# Altium schematic sheet Humidifier.SchDoc: Actuators
size A3; SheetNumber: 1; SheetTotal: 1
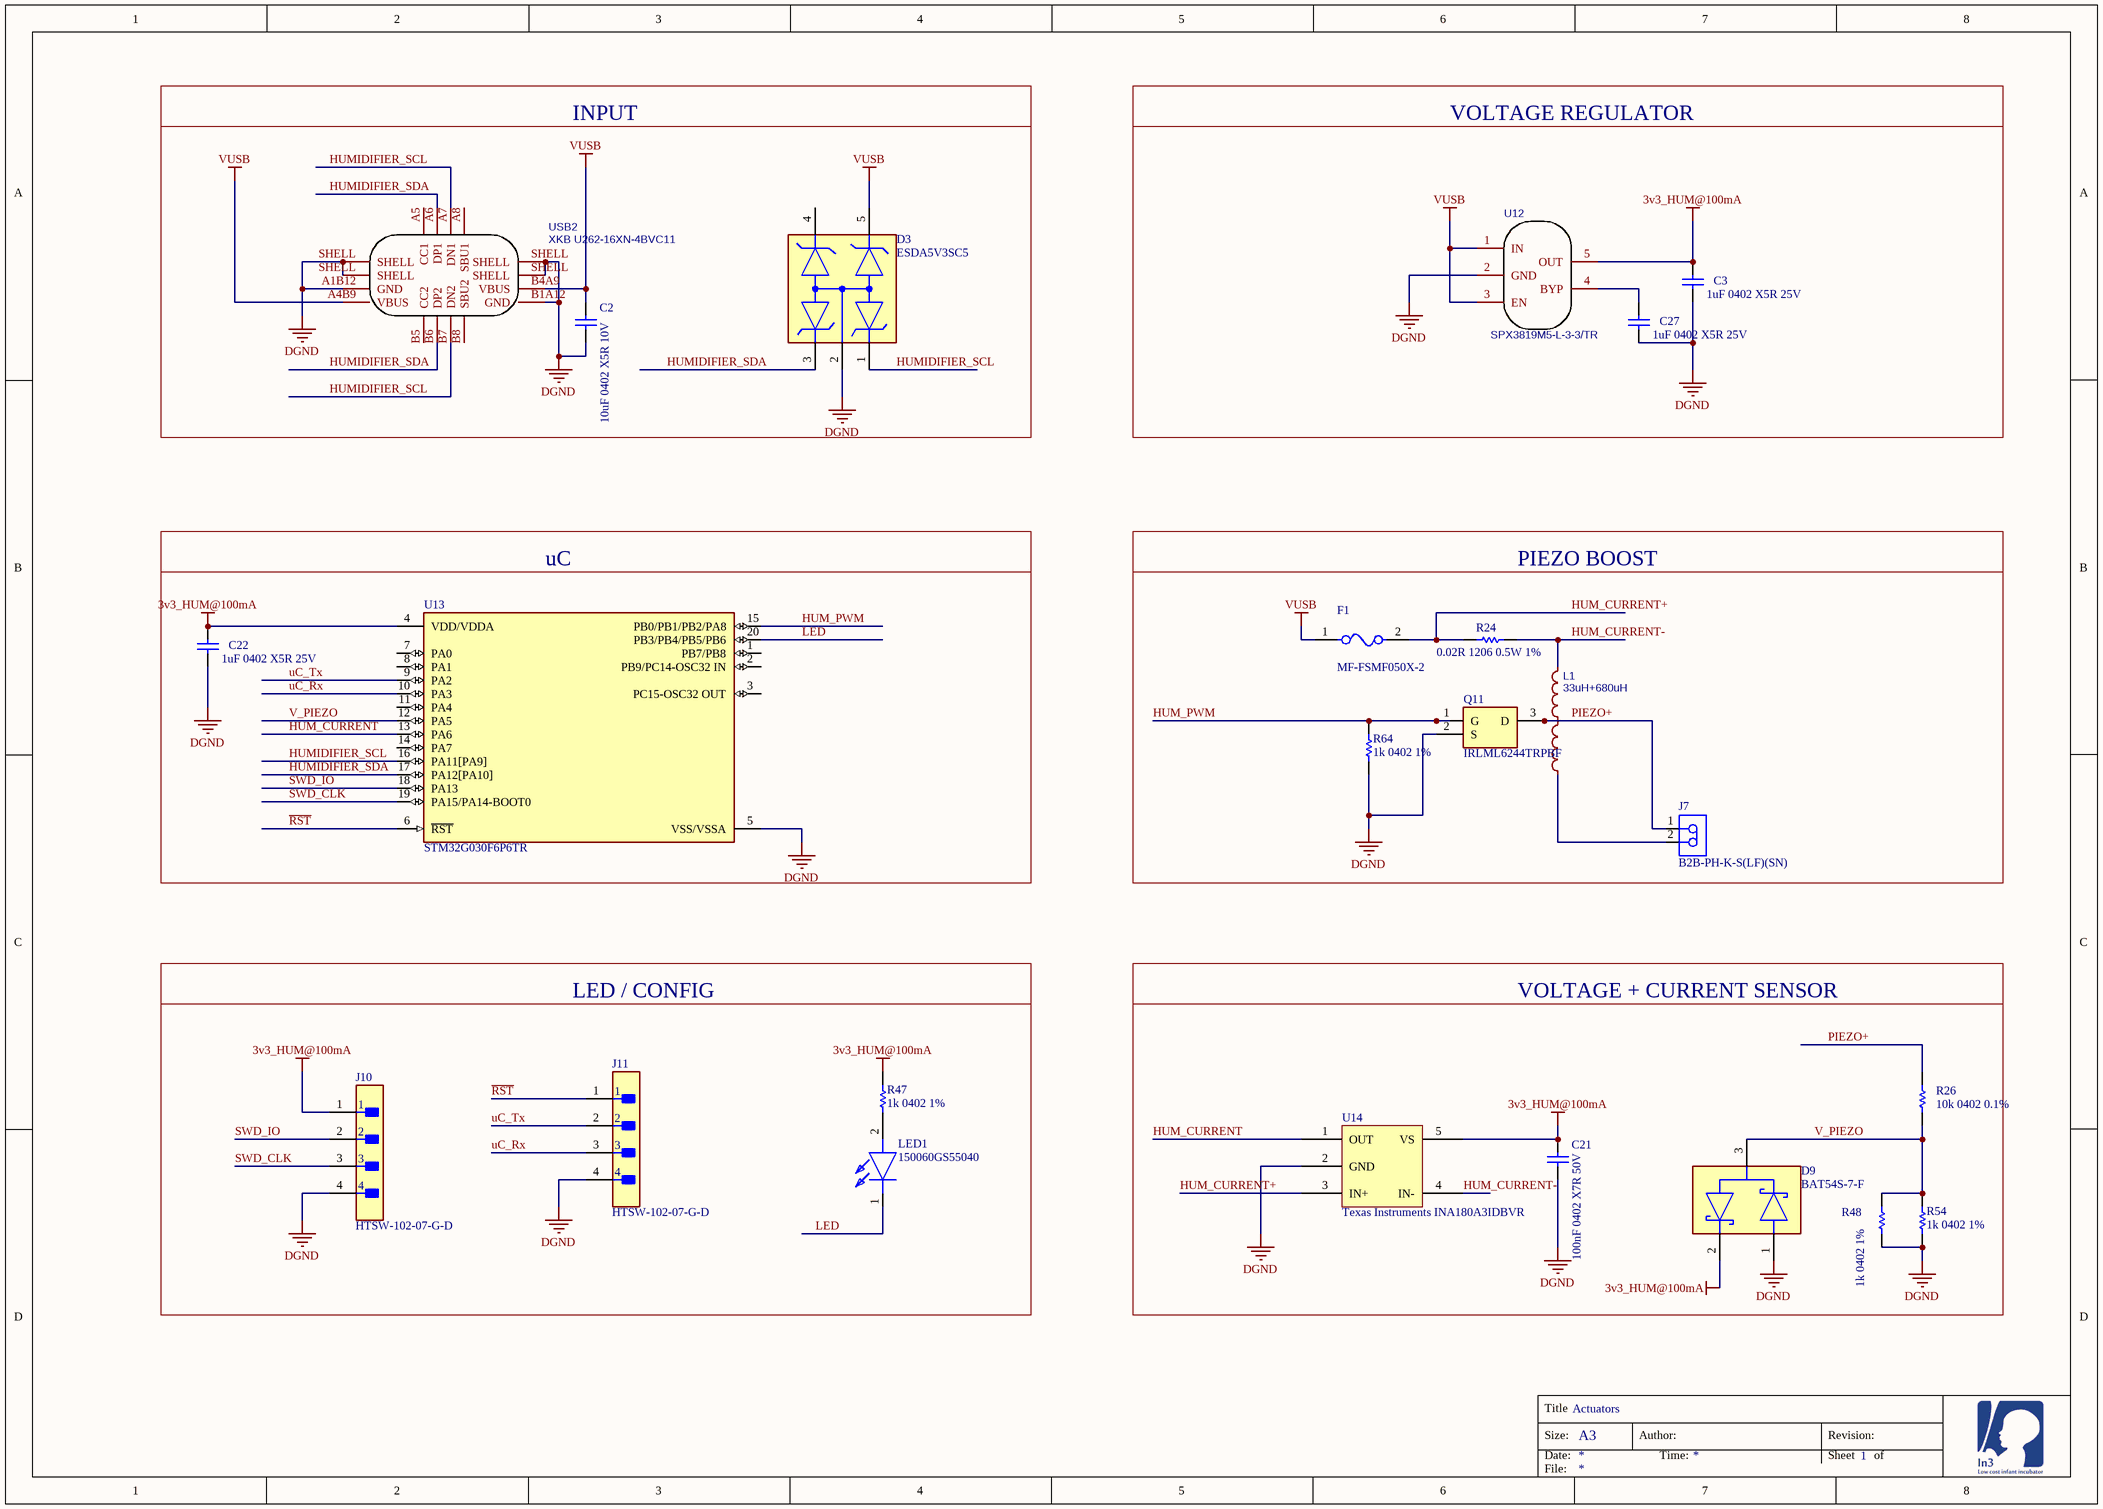
[diagram p0: Humidifier.SchDoc]

## Parts
C2  10uF 0402 X5R 10V  [CAPC1005X55X25NL5T10]
C3  1uF 0402 X5R 25V  [CAPC1005X55X25NL5T10]
C21  100nF 0402 X7R 50V  [CAPC1005X55X25NL5T10]
C22  1uF 0402 X5R 25V  [CAPC1005X55X25NL5T10]
C27  1uF 0402 X5R 25V  [CAPC1005X55X25NL5T10]
D3  ESDA5V3SC5  [FP-SOT23-5L-MFG]
D9  BAT54S-7-F  [FP-SOT23-MFG]
F1  MF-FSMF050X-2  [FP-MF-FSMF-MFG]
J7  B2B-PH-K-S(LF)(SN)  [JST-B2B-PH-K-S_V]
J10  HTSW-102-07-G-D  [FP-HTSW-102-07-G-D-MFG]
J11  HTSW-102-07-G-D  [FP-HTSW-102-07-G-D-MFG]
L1  33uH+680uH  [IND-THT_TRIPOD]
LED1  150060GS55040  [LEDC1608X50N]
Q11  IRLML6244TRPBF  [SOT95P237X112-3N]
R24  0.02R 1206 0.5W 1%  [CAPC3216X180X55ML20T25]
R26  10k 0402 0.1%  [RESC1005X40X25ML05T10]
R47  1k 0402 1%  [RESC1005X40X25ML05T10]
R48  1k 0402 1%  [RESC1005X40X25ML05T10]
R54  1k 0402 1%  [RESC1005X40X25ML05T10]
R64  1k 0402 1%  [RESC1005X40X25ML05T10]
U12  SPX3819M5-L-3-3/TR  [SOT-23-5_L3.0-W1.7-P0.95-LS2.8-BR]
U13  STM32G030F6P6TR  [FP-TSSOP20-YA-IPC_A]
U14  Texas Instruments INA180A3IDBVR  [SOT23-5_D]
USB2  XKB U262-16XN-4BVC11  [U262-161N-4BVC11]

## Blocks framed on the sheet
INPUT: C2 D3 USB2
VOLTAGE REGULATOR: C3 C27 U12
uC: C22 U13
PIEZO BOOST: F1 J7 L1 Q11 R24 R64
LED / CONFIG: J10 J11 LED1 R47
VOLTAGE + CURRENT SENSOR: C21 D9 R26 R48 R54 U14

## Nets
3v3_HUM@100mA: C3.2 C21.2 C22.2 D9.2 J10.1 R47.1 U12.5(OUT) U13.4(VDD/VDDA) U14.5(VS)
DGND: C2.1 C3.1 C21.1 C22.1 C27.1 D3.2 D9.1 J10.4 J11.4 Q11.2(S) R48.2 R54.2 R64.2 U12.2(GND) U13.5(VSS/VSSA) U14.2(GND) USB2.A1B12(GND) USB2.B1A12(GND) USB2.SHELL
VUSB: C2.2 D3.5 F1.1 U12.1(IN) U12.3(EN) USB2.A4B9(VBUS) USB2.B4A9(VBUS)
~{RST}: J11.1 U13.6(~{RST})
HUM_CURRENT: U13.13(PA6) U14.1(OUT)
HUM_CURRENT+: F1.2 R24.2 U14.3(IN+)
HUM_CURRENT-: L1.3 R24.1 U14.4(IN-)
HUM_PWM: Q11.1(G) R64.1 U13.15(PB0/PB1/PB2/PA8)
HUMIDIFIER_SCL: D3.1 U13.16(PA11[PA9]) USB2.A7(DN1) USB2.B7(DN2)
HUMIDIFIER_SDA: D3.3 U13.17(PA12[PA10]) USB2.A6(DP1) USB2.B6(DP2)
LED: LED1.1(K) U13.20(PB3/PB4/PB5/PB6)
PIEZO+: J7.1 L1.2 Q11.3(D) R26.2
SWD_CLK: J10.3 U13.19(PA15/PA14-BOOT0)
SWD_IO: J10.2 U13.18(PA13)
uC_Rx: J11.3 U13.10(PA3)
uC_Tx: J11.2 U13.9(PA2)
V_PIEZO: D9.3 R26.1 R48.1 R54.1 U13.12(PA5)
NetC27_2: C27.2 U12.4(BYP)
NetJ7_2: J7.2 L1.1
NetLED1_2: LED1.2(A) R47.2

Not connected (* = marked no-connect by the designer): D3 4; U13 1(PB7/PB8) 2(PB9/PC14-OSC32_IN) 3(PC15-OSC32_OUT) 7(PA0) 8(PA1) 11(PA4) 14(PA7); USB2 A5(CC1) A8(SBU1) B5(CC2) B8(SBU2)

## Notes on the sheet
- Title
- Size:
- Date:
- A3
- Author:
- Time:
- Revision:
- Sheet
- of
- File:

## Library data of the parts
C2 C3 C21 C22 C27 = CMP-1662-00020-1: ComponentLink2Description: Datasheet; ComponentLink2URL: http://psearch.en.murata.com/capacitor/product/GRM155R60J105KE19%23.pdf; ComponentLink1Description: Manufacturer URL; ComponentLink1URL: http://www.murata.com/
  C2: LCSC_PN: C77000
  C3 C22 C27: LCSC_PN: C77009
  C21: LCSC_PN: C77020
D3 = CMP-12225-000054-1: TVS DIODE 3V SOT23-5L; Manufacturer: STMicroelectronics; Standoff Height: 0mm; Peak Pulse Power: 300W; Direction: Unidirectional; Capacitance: 320pF; Breakdown Voltage: 5.3V; Clamping Voltage: 21V; Max Junction Temp: +150°C; Peak Pulse Current: 22A; Number Of Channels: 4; Value: 320pF; Device Class L3: unset; Category: Diode; Height: 1.45mm; Automotive: No; Mouser Description: TVS Diodes / ESD Suppressors 5.3V 500W Unidirect; Lead Free: Yes; Temperature Range Low: -55°C; Temperature: -55°C to +150°C; Digikey Description: TVS DIODE 3V SOT23-5L; Octopart: https://octopart.com/esda5v3sc5-stmicroelectronics-347709; Reverse Standoff Voltage: 3V; Temperature Range High: +150°C; Package: SOT23-5L; ComponentLink2Description: Datasheet; Device Class L2: TVS Diodes; Ipc Land Pattern Name: SOT95P280X118-5; Device Class L1: Circuit Protection; Manufacturer Part Number: ESDA5V3SC5; ComponentLink2URL: https://www.st.com/resource/en/datasheet/esda5v3sc5.pdf; RoHS: TRUE; LCSC_PN: C111204
D9 = CMP-1667-00006-2: DIODE ARRAY SCHOTTKY 30V SOT23-3; Forward Voltage: 800mV; Reverse Recovery Time: 5ns; Peak Non-Repetitive Surge Current: 600mA; Power Rating: 200mW; Current Rating: 200mA; Peak Reverse Current: 2uA; Capacitance: 10pF; Width: 1.3mm; Mount: Surface Mount; Height: 1mm; Number of Pins: 3; Weight: 0.000282oz; Max Reverse Voltage (DC): 30V; Max Power Dissipation: 200mW; Lead Free: Lead Free; Max Operating Temperature: 150°C; Min Operating Temperature: -65°C; Package Quantity: 3000; REACH SVHC: No SVHC; Termination: SMD/SMT; Max Forward Surge Current (Ifsm): 600mA; Radiation Hardening: No; Voltage Rating (DC): 30V; Average Rectified Current: 200mA; Max Repetitive Reverse Voltage (Vrrm): 30V; Contact Plating: Tin; Case/Package: SOT-23; Forward Current: 200mA; Power Dissipation: 200mW; Length: 2.9mm; Packaging: Tape and Reel; LCSC_PN: C83574
F1 = CMP-07400-000010-1: PTC RESET FUSE 6V 500MA 0603; Manufacturer: Bourns Inc.; Trip Current: 1A; Current Rating: 40A; Hold Current: 0.5A; Resistance: 0.1-0.8Ω; Value: 0.1-0.8Ω; Description: Polymeric PTC Resettable Fuse 6V 500mA Ih Surface Mount 0603 (1608 Metric), Concave; Trip Time: 0.1s; Mouser Description: Resettable Fuses - PPTC 6volts 40amps; Category: Fuse; Digikey Description: PTC RESET FUSE 6V 500MA 0603; Temperature: -40°C to +85°C; Device Class L3: unset; Automotive: No; RoHS: TRUE; Ambient Temperature Range High: +85°C; Device Class L2: PTC Resettable Fuses; Temperature Range High: +85°C; Voltage Rating: 6V; Package: MF-FSMF; Manufacturer Part Number: MF-FSMF050X-2; Ambient Temperature Range Low: -40°C; Lead Free: Yes; ComponentLink2Description: Datasheet; Octopart: https://octopart.com/mf-fsmf050x-2-bourns-10470804; ComponentLink2URL: https://www.bourns.com/docs/Product-Datasheets/mffsmf.pdf; Temperature Range Low: -40°C; Height: 1mm; Device Class L1: Circuit Protection
J7 = CMP-2000-05162-1: Male Header, Pitch 2 mm, 1 x 2 Position, Height 6 mm, Tail Length 3.4 mm, -25 to 85 degC, RoHS, Bulk; Manufacturer: JST; Pitch: 2mm; Style/Orientation: StraightHeader/Plug; No of Positions: 2; Datasheet Version: Nov-08; Datasheet URL: http://datasheet.octopart.com/B2B-PH-K-S%28LF%29%28SN%29-JST-datasheet-8324864.pdf; Manufacturer URL: http://www.jst.com/home2.html; Type: ShroudedHeader; Termination: Crimp; LCSC_PN: C131337
J10 J11 = CMP-02766-000010-1: CONN HEADER VERT 4POS 2.54MM; Manufacturer: Samtec; Voltage Rating: 550V; Conn Orientation: Straight; Number Of Contacts: 4; Conn Gender: Male; Current Rating: 6.3A; Number Of Rows: 2; Category: Conn; Temperature: -55°C to +125°C; Automotive: No; Digikey Description: CONN HEADER VERT 4POS 2.54MM; ComponentLink2URL: http://suddendocs.samtec.com/catalog_english/htsw_th.pdf; Device Class L2: Headers and Wire Housings; Mouser Description: Conn Unshrouded Header HDR 4 POS 2.54mm Solder ST Thru-Hole Bag; Manufacturer Part Number: HTSW-102-07-G-D; Temperature Range High: +125°C; Contact Material: Gold,Nickel; Temperature Range Low: -55°C; ComponentLink2Description: Datasheet; Device Class L1: Connectors; Pitch: 2.54mm; Octopart: https://octopart.com/htsw-102-07-g-d-samtec-10531767; RoHS: TRUE; Package: HTSW-102-07-G-D; Lead Free: Yes; Device Class L3: unset; Height: 8.71mm; LCSC_PN: C2685136
L1 = tripod_inductor
LED1 = 150060GS55040: LED; Manufacturer_Name: Wurth Elektronik; Datasheet Link: https://katalog.we-online.de/led/datasheet/150060GS55040.pdf; Height: 0.5mm; Manufacturer_Part_Number: 150060GS55040; Mouser Part Number: 710-150060GS55040; Mouser Price/Stock: https://www.mouser.co.uk/ProductDetail/Wurth-Elektronik/150060GS55040?qs=fAHHVMwC%252Bbhr5Aln2oA6Nw%3D%3D; LCSC_PN: C84266
Q11 = IRLML6244TRPBF: Transistor; Manufacturer_Name: Infineon; Datasheet Link: http://www.infineon.com/dgdl/irlml6244pbf.pdf?fileId=5546d462533600a4015356686fed261f; Height: 1.12mm; Manufacturer_Part_Number: IRLML6244TRPBF; Mouser Part Number: 942-IRLML6244TRPBF; Mouser Price/Stock: https://www.mouser.co.uk/ProductDetail/Infineon-IR/IRLML6244TRPBF?qs=9%252BKlkBgLFf1HkY%2F2U%252BIhLQ%3D%3D; Arrow Part Number: IRLML6244TRPBF; Arrow Price/Stock: https://www.arrow.com/en/products/irlml6244trpbf/infineon-technologies-ag?region=nac; LCSC_PN: C143946
R24 = CMP-0abdc173b10ad57a-1: Manufacturer Part Number: WSLP12065L000FEA; Resistance: 0,024; Power: 1W; Octopart URL: https://octopart.com/1-2176055-0-te+connectivity-46440145; Case/Package: 1206; Lifecycle Status: Not Listed by Manufacturer; Packaging: Tape & Reel (TR); OctopartID: 0abdc173b10ad57a; LCSC_PN: C723441
R26 R47 R48 R54 R64 = CMP-2002-07472-1
  R26: LCSC_PN: C190095
  R47 R48 R54 R64: LCSC_PN: C106235
U12 = SPX3819M5-L-3-3/TR: BOM_Manufacturer: EXAR; BOM_Supplier: LCSC; BOM_Manufacturer Part: SPX3819M5-L-3-3/TR; BOM_Supplier Part: C9055; BOM_JLCPCB Part Class: Extended Part; spicePre: U; spiceSymbolName: SPX3819M5-L-3-3/TR; LCSC_PN: C9055
U13 = CMP-12105-000113-1: IC MCU 32BIT 32KB FLASH 20TSSOP; RoHS Compliant: Yes; LCSC_PN: C529330
U14 = CMP-29d7e410373ef610-1: 26V, Low- or High-Side Voltage Output Current Sense Amplifier 5-SOT-23 -40 to 125; Lead-Free Status: Lead Free; Octopart URL: http://octopart.com/ina180a1idbvr-texas+instruments-80558991; Manufacturer Part Number: INA180A3IDBVR; OctopartID: 29d7e410373ef610; RoHS: Compliant; Footprint: PCB-0002-02157-1.A.1; Lifecycle Status: Active; LCSC_PN: C122882
USB2 = XKB U262-16XN-4BVC11: BOM_Manufacturer: XKB Enterprise; Contributor: LCSC; BOM_Supplier: LCSC; BOM_Supplier Part: C319148; BOM_Manufacturer Part: U262-16XN-4BVC11; BOM_JLCPCB Part Class: Extended Part; LCSC_PN: C319148